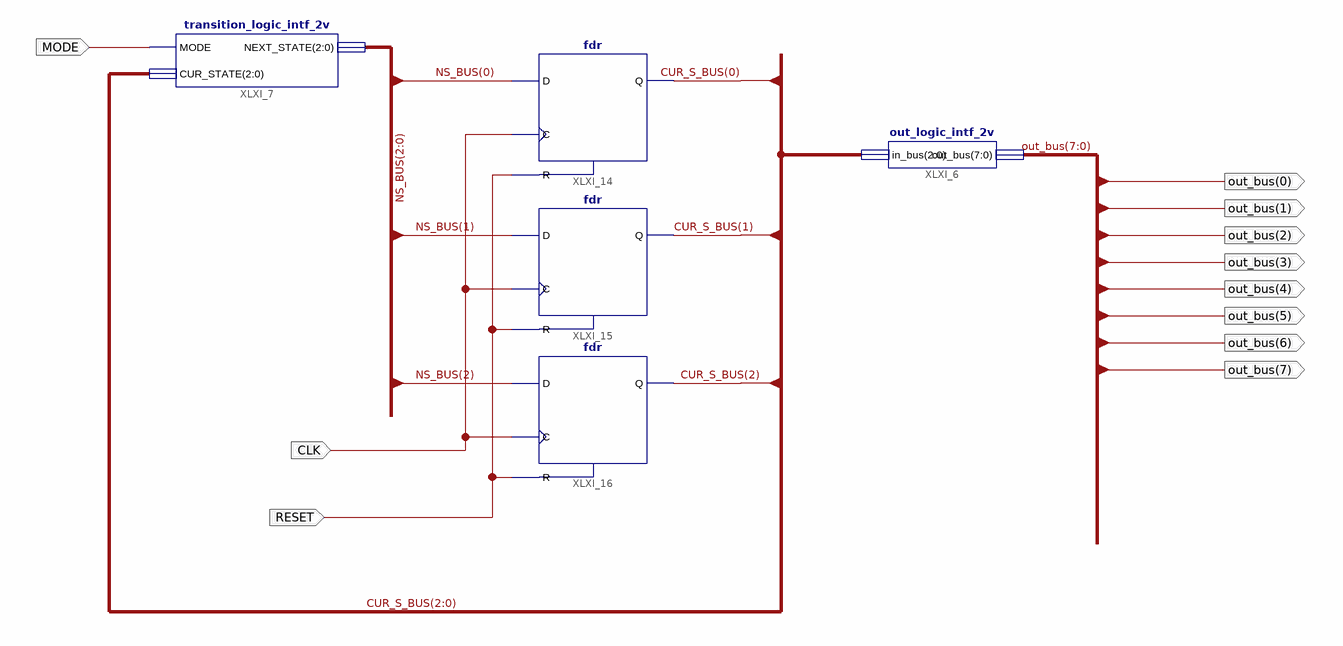
[diagram p0: schematic sheet 1]
// Xilinx ISE schematic LightController.sch (spartan3a) as structural Verilog: 5 symbols, 11 ports
module LightController (
  input  MODE,
  input  CLK,
  input  RESET,
  output [7:0] out_bus
);

  wire [2:0] CUR_S_BUS, NS_BUS;

  out_logic_intf_2v XLXI_6 (.in_bus(CUR_S_BUS), .out_bus(out_bus));
  transition_logic_intf_2v XLXI_7 (.MODE(MODE), .CUR_STATE(CUR_S_BUS), .NEXT_STATE(NS_BUS));
  fdr XLXI_14 (.C(CLK), .D(NS_BUS[0]), .R(RESET), .Q(CUR_S_BUS[0]));
  fdr XLXI_15 (.C(CLK), .D(NS_BUS[1]), .R(RESET), .Q(CUR_S_BUS[1]));
  fdr XLXI_16 (.C(CLK), .D(NS_BUS[2]), .R(RESET), .Q(CUR_S_BUS[2]));
endmodule
